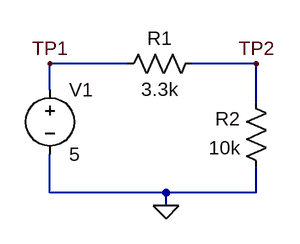
[diagram p0: schematic Draft1.asc]
Draft1.asc, the LTspice schematic file:
Version 4
SHEET 1 880 680
WIRE 112 80 16 80
WIRE 272 80 192 80
WIRE 16 112 16 80
WIRE 272 128 272 80
WIRE 16 240 16 192
WIRE 160 240 16 240
WIRE 272 240 272 208
WIRE 272 240 160 240
WIRE 160 256 160 240
FLAG 160 256 0
FLAG 16 80 TP1
FLAG 272 80 TP2
SYMBOL voltage 16 96 R0
WINDOW 123 0 0 Left 0
WINDOW 39 0 0 Left 0
SYMATTR InstName V1
SYMATTR Value 5
SYMBOL res 208 64 R90
WINDOW 0 0 56 VBottom 2
WINDOW 3 32 56 VTop 2
SYMATTR InstName R1
SYMATTR Value 3.3k
SYMBOL res 288 224 R180
WINDOW 0 36 76 Left 2
WINDOW 3 36 40 Left 2
SYMATTR InstName R2
SYMATTR Value 10k

The netlist it stands for:
* Draft1.asc
V1 TP1 0 5
R1 TP2 TP1 3.3k
R2 0 TP2 10k
.backanno
.end